# Altium schematic sheet 02_Power_Diagram.SchDoc
size A4; Date: 19/03/2023; CheckedBy: YenDoo; DrawnBy: Hnit; DocumentNumber: 02; Revision: 01; Time: 0:00:00
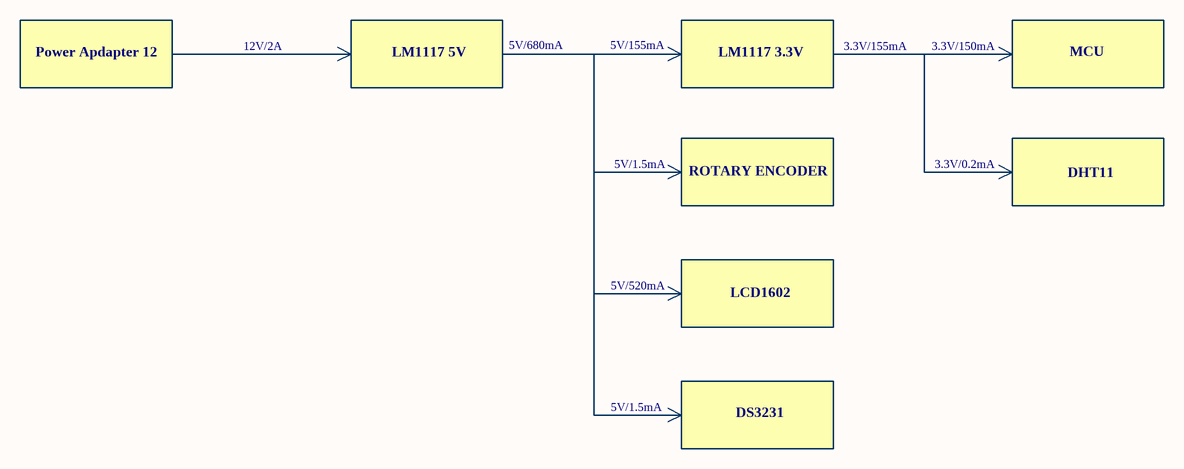
[diagram p0: 02_Power_Diagram.SchDoc]

## Notes on the sheet
- 12V/2A
- 5V/680mA
- 5V/155mA
- 3.3V/155mA
- 3.3V/150mA
- Power Apdapter 12
- LM1117 5V
- LM1117 3.3V
- MCU
- 5V/1.5mA
- ROTARY ENCODER
- 3.3V/0.2mA
- DHT11
- 5V/520mA
- LCD1602
- DS3231
- Title
- Size
- Number
- Revision
- Date
- Draw by:
- A4
- Check by:
- Time
- File: